# Altium schematic sheet Res 1M 805.schdoc
size 127 x 99 mm
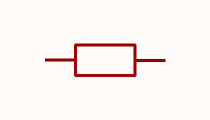
[diagram p0: Res 1M 805.schdoc]

## Parts
R?  1MΩ  [R0805]  (value not drawn)

## Nets

Not connected (* = marked no-connect by the designer): R? 1 2

## Library data of the parts
R? = ERJP06J105V: Manufacturer: PANASONIC(松下); Add into BOM: yes; Tolerance: ±5%; Temperature Coefficient: ±200ppm/℃; Symbol: ERJP06J105V; Device: ERJP06J105V; LCSC Part Name: 1MΩ ±5% 500mW 厚膜电阻; Supplier Part: C441966; Manufacturer Part: ERJP06J105V; Supplier Footprint: 0805; JLCPCB Part Class: Extended Part; Supplier: LCSC; Convert to PCB: yes; Type: Thick Film Resistors; Value: 1MΩ; Overload Voltage (Max): -; Operating Temperature Range: -55℃~+155℃